# Altium schematic sheet 1_zasilanie.SchDoc
size A4
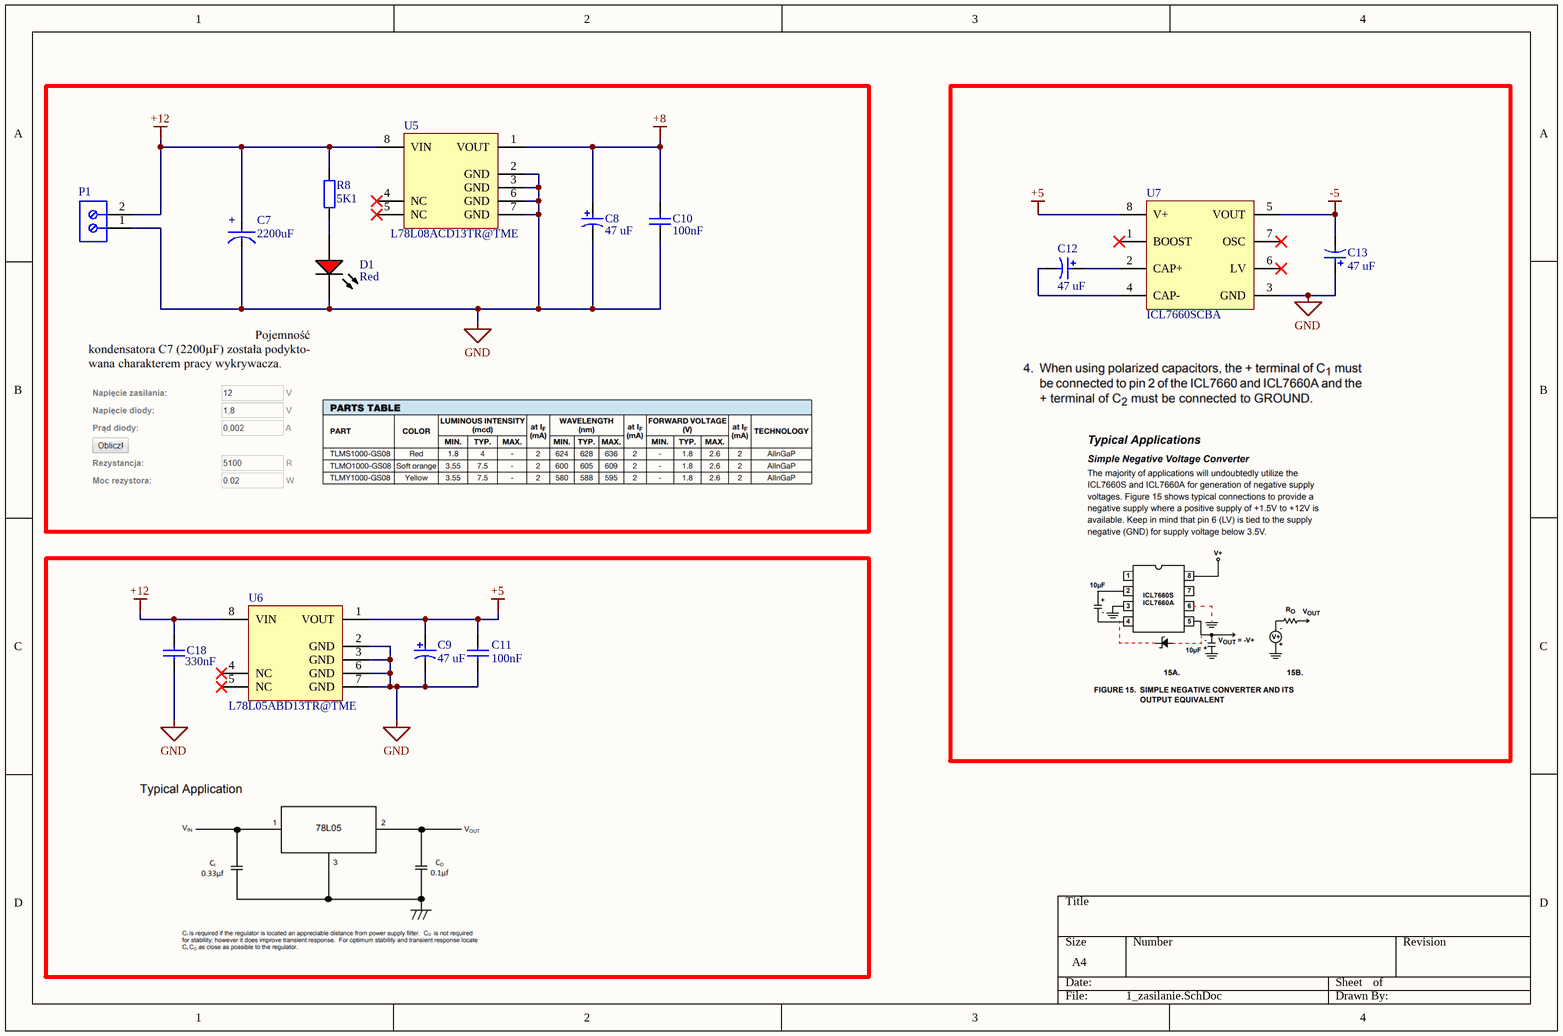
[diagram p0: 1_zasilanie.SchDoc]

## Parts
C7  Capacitance: 2200uF  [18 X 25mm Radial 7.5mm]  (hidden comment: Cap Electrolytic)
C8  Rated Capacitance: 47 uF  [NIC-CAPA2-6.3X5.8_V]  (hidden comment: UUD1E470MCL1GS)
C9  Rated Capacitance: 47 uF  [NIC-CAPA2-6.3X5.8_V]  (hidden comment: UUD1E470MCL1GS)
C10  Capacitance: 100nF  [0603]  (hidden comment: CL10B104KA8NNNC@TME)
C11  Capacitance: 100nF  [0603]  (hidden comment: CL10B104KA8NNNC@TME)
C12  Rated Capacitance: 47 uF  [NIC-CAPA2-6.3X5.8_V]  (hidden comment: UUD1E470MCL1GS)
C13  Rated Capacitance: 47 uF  [NIC-CAPA2-6.3X5.8_V]  (hidden comment: UUD1E470MCL1GS)
C18  value 330nF  [CAPC1608X90X35ML15T15]  (hidden comment: 0603YD334KAT2A)
D1  LED Colour: Red  [VISH-TLMS1000_V]  (hidden comment: TLMS1000-GS08)
P1  282836-2@TME  [TECO-282836-2_V]  (value not drawn)
R8  value 5K1  [R1206]  (hidden comment: 1206S4J0102T5E@TME)
U5  L78L08ACD13TR@TME  [SO8_M]
U6  L78L05ABD13TR@TME  [SO8_N]
U7  ICL7660SCBA  [INTS-SOIC-8_V]

## Nets
+5: C9.1 C11.1 U6.1(VOUT) U7.8(V+)
+8: C8.1 C10.1 U5.1(VOUT)
+12: C7.2(+) C18.1 P1.2(-) R8.2 U5.8(VIN) U6.8(VIN)
-5: C13.2 U7.5(VOUT)
GND: C7.1(-) C8.2 C9.2 C10.2 C11.2 C13.1 C18.2 D1.2(K) P1.1(+) U5.2(GND) U5.3(GND) U5.6(GND) U5.7(GND) U6.2(GND) U6.3(GND) U6.6(GND) U6.7(GND) U7.3(GND)
NetC12_1: C12.1 U7.2(CAP+)
NetC12_2: C12.2 U7.4(CAP-)
NetD1_1: D1.1(A) R8.1

Not connected (* = marked no-connect by the designer): U5 4(NC)* 5(NC)*; U6 4(NC)* 5(NC)*; U7 1(BOOST)* 6(LV)* 7(OSC)*

## Library data of the parts
C7 = Cap Electrolytic: CAPACITOR ALUM 2200UF 20% 35V RADIAL
C8 C9 C12 C13 = CMP-0687-00039-1: Aluminum Electrolytic Capacitor, UD Series, Low Impedance, 47 uF, 25 V, + / - 20%, -55 to 105 degC, Chip Type, 6.3 x 5.8 mm D x L, Pb-Free, Reel; Manufacturer: Nichicon; Rated Ripple Current (at 100kHz): 230 mA; Endurance Time: 2000 h; Packing: Dia382mm Reel; Rated Voltage: 25 V; Impedance: 0.44 Ohm; Tolerance Rated Capacitance: -20 to 20%; Mounting Technology: Surface Mount; Diameter: 6.3 mm; PartNumber: UUD1E470MCL1GS; ComponentLink3Description: Package Specification; ComponentLink2Description: Datasheet; PackageReference: CAPAE-D6.3H5.8; RoHS: TRUE; Length: 5.8 mm; ComponentLink1URL: http://www.nichicon.co.jp/; PackageDescription: 2-Pin Surface Mount Device, Diameter 6.3 mm, Height 5.8 mm, Pitch 5.4 mm; ComponentLink2URL: http://products.nichicon.co.jp/en/pdf/XJA043/e-ud.pdf; ComponentLink1Description: Manufacturer URL; ComponentLink3URL: http://products.nichicon.co.jp/en/pdf/XJA043/e-ud.pdf; DatasheetVersion: 08/2012
C10 C11 = Cap: Capacitor
C18 = CMP-2006-04538-1: Manufacturer: AVX Interconnect / Elco; Part Number: 0603YD334KAT2A
D1 = CMP-2000-07254-1: Low Current LED, 40 mW, 1.8 V, -40 to 100 degC, 2-Pin SMD (0603), RoHS, Tape and Reel; Manufacturer: Vishay; Lens Shape: Rectangular; Automotive Qualification Standard: AEC-Q100; Wavelength Typ: 636nm; SVHC: ToBeAdvised; Bulb Size: 1.6mmx0.8mm; Forward Voltage: 1.8V; Luminous Intensity: 4mcd; Forward Current If: 2mA; Viewing Angle: 80°; Datasheet Version: Rev. 1.7, 02/2011; Datasheet URL: https://datasheet.ciiva.com/5798/1698881-5798337.pdf; LED Mounting: SMD; Packaging: CutTape; Package Reference: TLMS1000; Manufacturer URL: http://www.vishay.com/; Mounting Technology: SurfaceMount; Product Range: -; Package Description: 2-Pin Surface Mount Device, Body 1.6 x 0.8 mm; MSL: MSL2-1year
P1 = CMP-1684-00017-1: Female Header, Pitch 5 mm, 1 x 2 Position, Height 10 mm, Tail Length 3.5 mm, Rohs, Bulk; Manufacturer: TE Connectivity; Wire Gauge: 16-30AWG; Product Training Modules: Wire-to-BoardEurostyleTerminalBlocks; Clamp Material - Plating: Brass-NickelPlated; Voltage: 300V; Mating Orientation: HorizontalwithBoard; Current: 13.5A; Pitch: 0.197"(5.00mm); Screw Thread: M3; 3D Model: 282836-2.pdf; Other Names: 5ULV-02B / A98076; Dynamic Catalog: BuchananSeries; Number of Levels: 1; Torque - Screw: 0.68Nm(6Lb-In); Featured Product: EurostyleTerminalBlockConnectors; Positions Per Level: 2; Wire Termination: Screw-RisingCageClamp; Datasheet URL: http://www.te.com.cn/commerce/DocumentDelivery/DDEController?Action=showdoc&DocId=Catalog+Section%7F1308389_EUROSTYLE_TERMINAL_BLOCKS%7F0607%7Fpdf%7FEnglish%7FENG_CS_1308389_EUROSTYLE_TERMINAL_BLOCKS_0607.pdf%7F282836-2; Color: Green; Family: TerminalBlocks-WiretoBoard; RoHS Information: 282836-2StatementofCompliance; Standard Package: 300; Contact Material - Plating: Brass-TinPlated; Manufacturer URL: http://www.te.com; Housing Material: Polyamide(PA66),Nylon6/6; Features: Interlocking(Side); Package Description: Female Header, Pitch 5 mm, 1 x 2 Position, Height 10 mm, Tail Length 3.5 mm; Mounting Type: ThroughHole; Package Reference: THD; Packaging: Bulk; Series: Buchanan; Category: Connectors,Interconnects; Screw Material - Plating: Brass-NickelPlated
R8 = Res: Resistor
U5 = CMP-0244-00234-1: Positive Voltage Regulator, 8V, 8-Pin SO, Tape and Reel; PackageVersion: 1/12/2002; DatasheetVersion: 1/02/2011; Code_IPC: SOIC127P600-8; PackageDescription: 8-Pin Small Outline Integrated Circuit 1.27 mm Pitch; ComponentLink3Description: Package Specification; Code_JEDEC: MS-012-AA; PackageReference: SO8; ComponentLink3URL: http://www.st.com/internet/com/TECHNICAL_RESOURCES/TECHNICAL_LITERATURE/PACKAGE_INFORMATION/CD00004680.pdf; ComponentLink1Description: Manufacturer URL; ComponentLink2Description: Datasheet; ComponentLink2URL: http://www.st.com/internet/com/TECHNICAL_RESOURCES/TECHNICAL_LITERATURE/DATASHEET/CD00000446.pdf; ComponentLink1URL: http://www.st.com
U6 = CMP-0244-00242-1: Positive Voltage Regulator, 5V, 8-Pin SO, Tape and Reel; ComponentLink2URL: http://www.st.com/internet/com/TECHNICAL_RESOURCES/TECHNICAL_LITERATURE/DATASHEET/CD00000446.pdf; ComponentLink3URL: http://www.st.com/internet/com/TECHNICAL_RESOURCES/TECHNICAL_LITERATURE/PACKAGE_INFORMATION/CD00004680.pdf; Code_IPC: SOIC127P600-8; PackageDescription: 8-Pin Small Outline Integrated Circuit 1.27 mm Pitch; ComponentLink3Description: Package Specification; ComponentLink2Description: Datasheet; DatasheetVersion: 1/02/2011; PackageVersion: 1/12/2002; Code_JEDEC: MS-012-AA; ComponentLink1URL: http://www.st.com; ComponentLink1Description: Manufacturer URL; PackageReference: SO8
U7 = CMP-2000-06437-1: Charge Pump Switching Regulator IC Positive or Negative Fixed, 1.5 to 12 V, 0 to 70 degC, RoHS, Tube; Manufacturer: Intersil; Number of Outputs: 1; Frequency - Switching: 10kHz,35kHz; Dynamic Catalog: InvertingIC; Current - Output: 45mA; Voltage - Input: 1.5V~12V; Output Type: Adjustable; Synchronous Rectifier: No; Voltage - Output: -1.5V~-12V,±3V~±24V; Package URL: http://www.intersil.com/content/dam/Intersil/documents/m8_1/m8.15.pdf; Standard Package: 98; Type: SwitchedCapacitor(ChargePump),Doubler,Inverting; Datasheet Version: 01/2013; Package Description: 8-Pin Small Outline Integrated Circuit, Body 4.9 x 3.9 mm, Pitch 1.27 mm; Category: IntegratedCircuits(ICs); Operating Temperature: 0°C~70°C; Mounting Technology: SurfaceMount; Package / Case: 8-SOIC(0.154",3.90mmWidth); Mounting Type: SurfaceMount; Series: -; Family: PMIC-VoltageRegulators-DCDCSwitchingRegulators; Packaging: Tube; PWM Type: -; Supplier Device Package: 8-SOIC; Datasheet URL: http://www.intersil.com/content/dam/intersil/documents/icl7/icl7660s-a.pdf; Package Reference: SOIC-8; Manufacturer URL: http://www.intersil.com/en.html